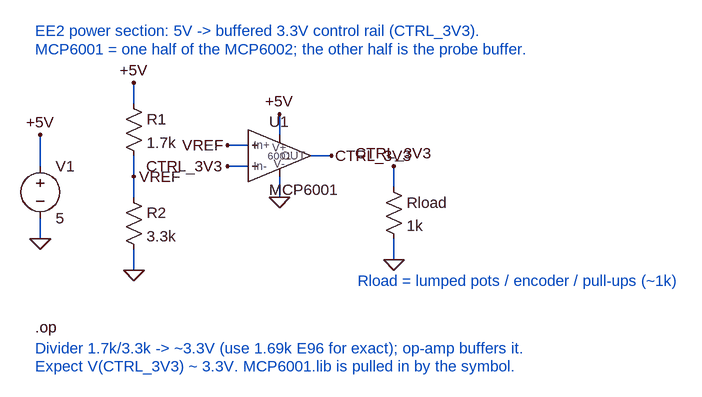
[diagram p0: schematic power_3v3_rail.asc]
power_3v3_rail.asc, the LTspice schematic file:
Version 4
SHEET 1 1056 760
WIRE 32 64 32 112
WIRE 32 192 32 224
WIRE 176 -16 176 16
WIRE 176 96 176 128
WIRE 176 128 176 160
WIRE 176 240 176 272
WIRE 320 80 352 80
WIRE 320 112 352 112
WIRE 400 32 400 64
WIRE 400 128 400 160
WIRE 448 96 480 96
WIRE 576 112 576 144
WIRE 576 224 576 256
FLAG 32 64 +5V
FLAG 32 224 0
FLAG 176 -16 +5V
FLAG 176 128 VREF
FLAG 176 272 0
FLAG 320 80 VREF
FLAG 320 112 CTRL_3V3
FLAG 400 32 +5V
FLAG 400 160 0
FLAG 480 96 CTRL_3V3
FLAG 576 112 CTRL_3V3
FLAG 576 256 0
SYMBOL voltage 32 96 R0
SYMATTR InstName V1
SYMATTR Value 5
SYMBOL res 160 0 R0
SYMATTR InstName R1
SYMATTR Value 1.7k
SYMBOL res 160 144 R0
SYMATTR InstName R2
SYMATTR Value 3.3k
SYMBOL MCP6001 400 96 R0
SYMATTR InstName U1
SYMBOL res 560 128 R0
SYMATTR InstName Rload
SYMATTR Value 1k
TEXT 24 -96 Left 2 ;EE2 power section: 5V -> buffered 3.3V control rail (CTRL_3V3).
TEXT 24 -68 Left 2 ;MCP6001 = one half of the MCP6002; the other half is the probe buffer.
TEXT 520 288 Left 2 ;Rload = lumped pots / encoder / pull-ups (~1k)
TEXT 24 360 Left 2 !.op
TEXT 24 392 Left 2 ;Divider 1.7k/3.3k -> ~3.3V (use 1.69k E96 for exact); op-amp buffers it.
TEXT 24 420 Left 2 ;Expect V(CTRL_3V3) ~ 3.3V. MCP6001.lib is pulled in by the symbol.

The netlist it stands for:
* power_3v3_rail.asc
V1 +5V 0 5
R1 +5V VREF 1.7k
R2 VREF 0 3.3k
XU1 VREF CTRL_3V3 +5V 0 CTRL_3V3 MCP6001  ; pins In+ In- V+ V- OUT
Rload CTRL_3V3 0 1k
* EE2 power section: 5V -> buffered 3.3V control rail (CTRL_3V3).
* MCP6001 = one half of the MCP6002; the other half is the probe buffer.
* Rload = lumped pots / encoder / pull-ups (~1k)
.op
* Divider 1.7k/3.3k -> ~3.3V (use 1.69k E96 for exact); op-amp buffers it.
* Expect V(CTRL_3V3) ~ 3.3V. MCP6001.lib is pulled in by the symbol.
.lib MCP6001.lib
.backanno
.end